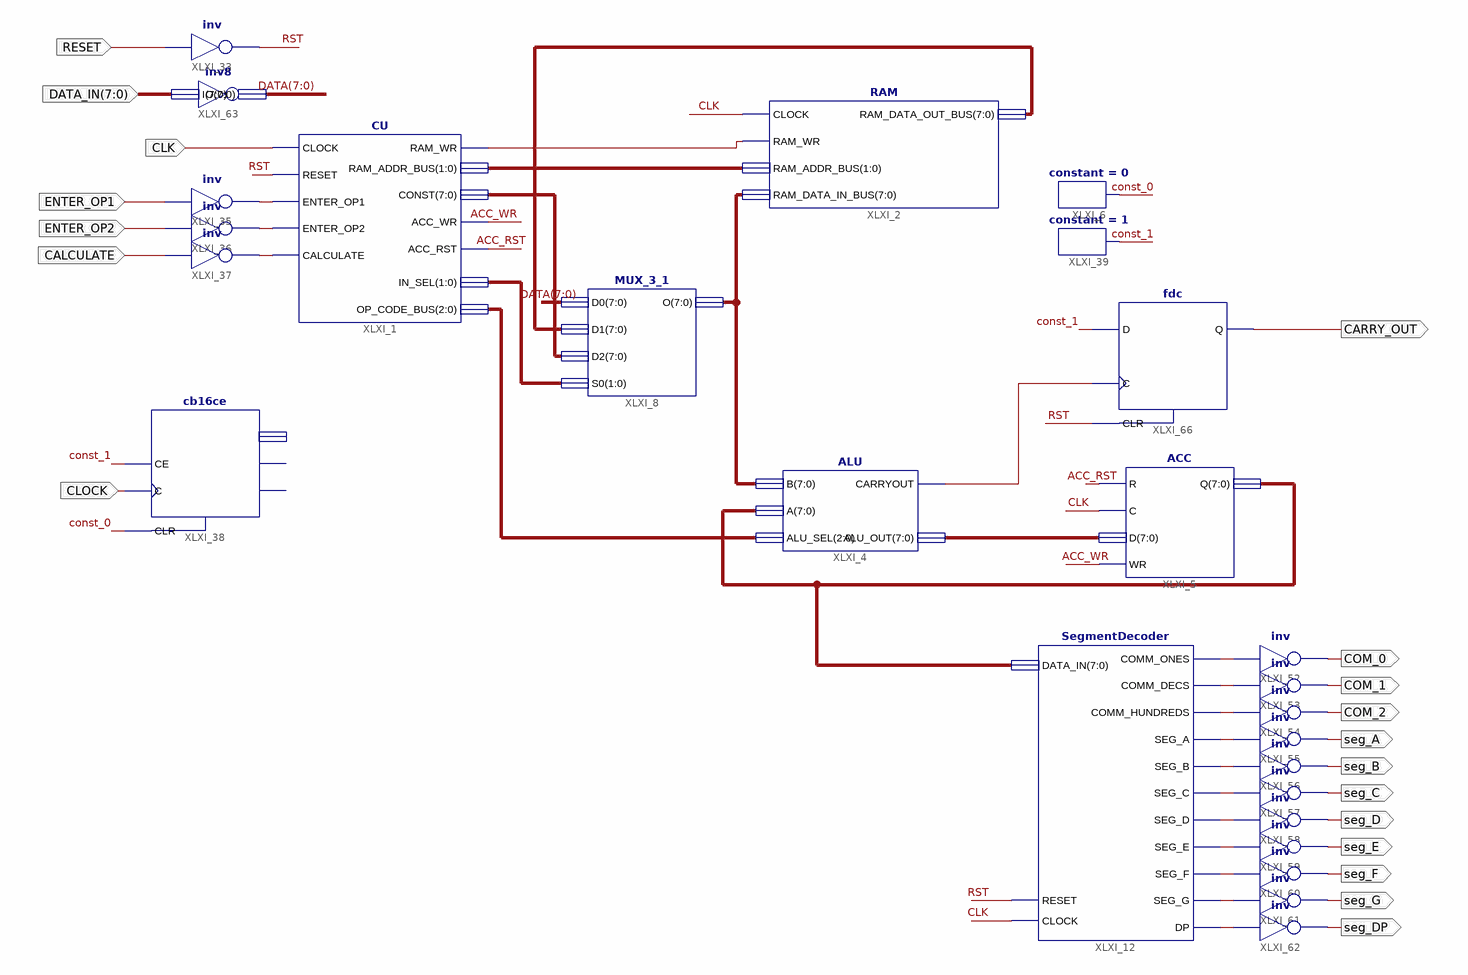
[diagram p0: schematic sheet 1]
// Xilinx ISE schematic TopLevel.sch (spartan3a) as structural Verilog: 26 symbols, 19 ports
module TopLevel (
  input  [7:0] DATA_IN,
  input  RESET,
  input  ENTER_OP1,
  input  ENTER_OP2,
  input  CALCULATE,
  input  CLOCK,
  input  CLK,
  output CARRY_OUT,
  output COM_0,
  output COM_1,
  output COM_2,
  output seg_A,
  output seg_B,
  output seg_C,
  output seg_D,
  output seg_E,
  output seg_F,
  output seg_G,
  output seg_DP
);

  wire ACC_RST, ACC_WR, const_0, const_1, RAM_WR, RST, XLXN_179, XLXN_180, XLXN_181, XLXN_199, XLXN_200,
       XLXN_201, XLXN_202, XLXN_203, XLXN_204, XLXN_205, XLXN_206, XLXN_207, XLXN_208, XLXN_209, XLXN_217;
  wire [1:0] RAM_ADDR_BUS, XLXN_96;
  wire [2:0] XLXN_98;
  wire [7:0] A, ALU_OUT, B, DATA, RAM_DATA_OUT, XLXN_92;

  CU XLXI_1 (
    .CLOCK(CLK), .RESET(RST), .ENTER_OP1(XLXN_179), .ENTER_OP2(XLXN_180), .CALCULATE(XLXN_181),
    .RAM_WR(RAM_WR), .ACC_WR(ACC_WR), .ACC_RST(ACC_RST), .RAM_ADDR_BUS(RAM_ADDR_BUS), .CONST(XLXN_92),
    .IN_SEL(XLXN_96), .OP_CODE_BUS(XLXN_98));
  RAM XLXI_2 (
    .CLOCK(CLK), .RAM_WR(RAM_WR), .RAM_ADDR_BUS(RAM_ADDR_BUS), .RAM_DATA_IN_BUS(B),
    .RAM_DATA_OUT_BUS(RAM_DATA_OUT));
  ALU XLXI_4 (.B(B), .A(A), .ALU_SEL(XLXN_98), .CARRYOUT(XLXN_217), .ALU_OUT(ALU_OUT));
  ACC XLXI_5 (.R(ACC_RST), .C(CLK), .D(ALU_OUT), .WR(ACC_WR), .Q(A));
  MUX_3_1 XLXI_8 (.D0(DATA), .D1(RAM_DATA_OUT), .D2(XLXN_92), .S0(XLXN_96), .O(B));
  SegmentDecoder XLXI_12 (
    .COMM_ONES(XLXN_199), .COMM_DECS(XLXN_200), .COMM_HUNDREDS(XLXN_201), .SEG_A(XLXN_202), .SEG_B(XLXN_203),
    .SEG_C(XLXN_204), .SEG_D(XLXN_205), .SEG_E(XLXN_206), .SEG_F(XLXN_207), .SEG_G(XLXN_208), .DP(XLXN_209),
    .DATA_IN(A), .CLOCK(CLK), .RESET(RST));
  not XLXI_36 (XLXN_180, ENTER_OP2);
  not XLXI_37 (XLXN_181, CALCULATE);
  cb16ce XLXI_38 (.C(CLOCK), .CE(const_1), .CLR(const_0));  // open: CEO, Q, TC
  not XLXI_52 (COM_0, XLXN_199);
  not XLXI_53 (COM_1, XLXN_200);
  not XLXI_54 (COM_2, XLXN_201);
  not XLXI_55 (seg_A, XLXN_202);
  not XLXI_56 (seg_B, XLXN_203);
  not XLXI_57 (seg_C, XLXN_204);
  not XLXI_58 (seg_D, XLXN_205);
  not XLXI_59 (seg_E, XLXN_206);
  not XLXI_60 (seg_F, XLXN_207);
  not XLXI_61 (seg_G, XLXN_208);
  not XLXI_62 (seg_DP, XLXN_209);
  inv8 XLXI_63 (.I(DATA_IN), .O(DATA));
  not XLXI_33 (RST, RESET);
  constant #(.CValue("1")) XLXI_39 (.O(const_1));
  constant #(.CValue("0")) XLXI_6 (.O(const_0));
  not XLXI_35 (XLXN_179, ENTER_OP1);
  fdc XLXI_66 (.C(XLXN_217), .CLR(RST), .D(const_1), .Q(CARRY_OUT));
endmodule
